# Altium schematic sheet main.SchDoc
size A
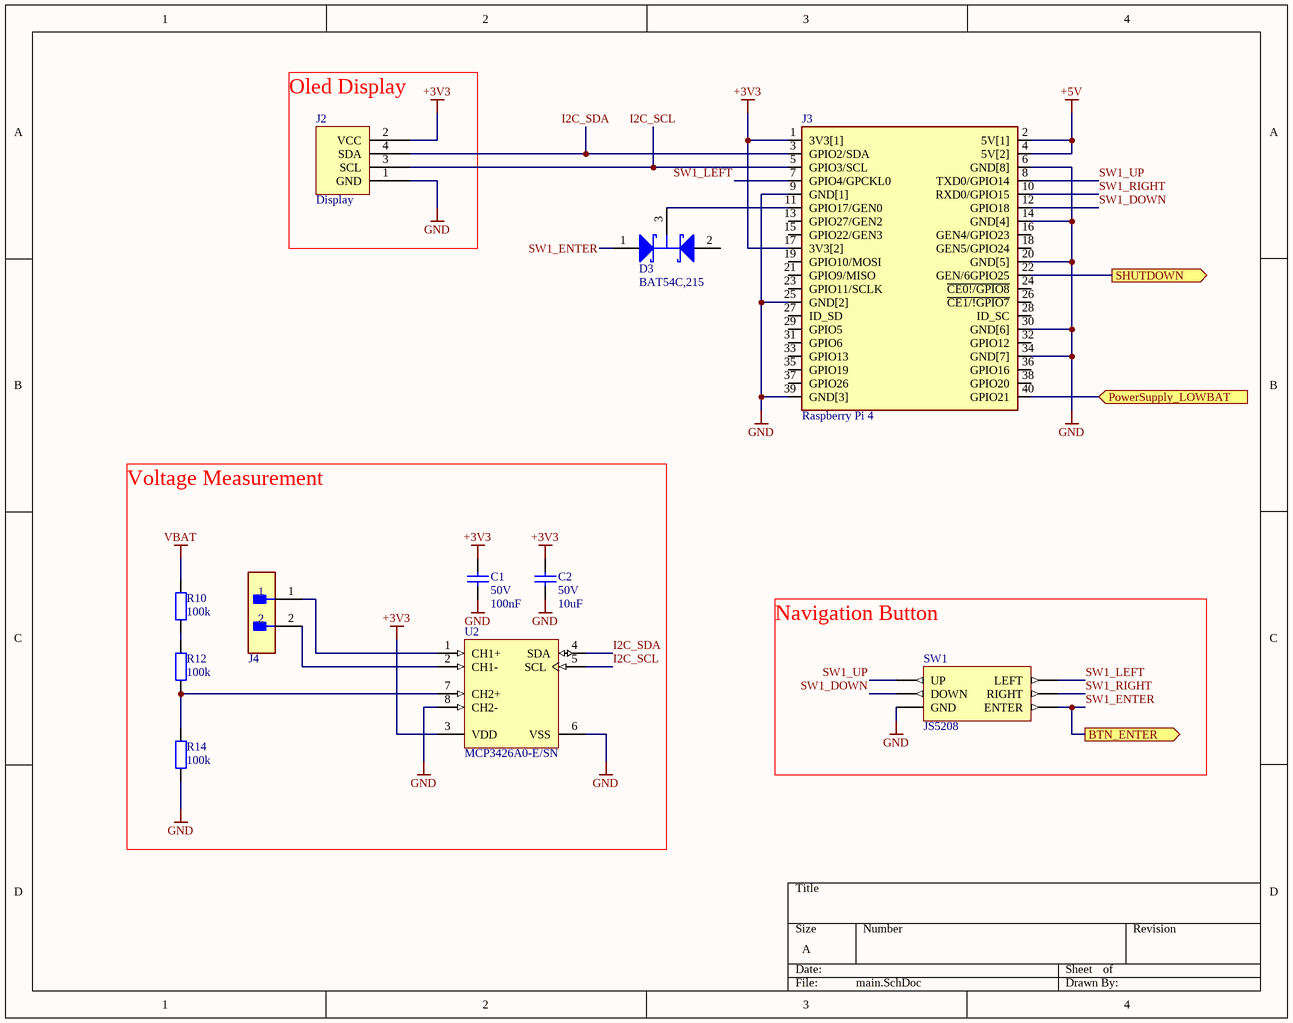
[diagram p0: main.SchDoc]

## Parts
C1  value 100nF  Voltage Rating: 50V  [CAPC2013X88X50NL20T25]  (hidden comment: Cap_0805)
C2  value 10uF  Voltage Rating: 50V  [CAPC2013X88X50NL20T25]  (hidden comment: Cap_0805)
D3  BAT54C,215  [SOT23]
J2  Display  [OLED_DISPLAY]
J3  Raspberry Pi 4  [RASPBERRY_PI_4]
J4  ADC_header  [ADC_HEADER]  (value not drawn)
R10  value 100k  [RESC2013X50X30NL20T20]  (hidden comment: Res_0805)
R12  value 100k  [RESC2013X50X30NL20T20]  (hidden comment: Res_0805)
R14  value 100k  [RESC2013X50X30NL20T20]  (hidden comment: Res_0805)
SW1  JS5208  [JS5208_PKG]
U2  MCP3426A0-E/SN  [SOIC-SN8_L]

## Ports
BTN_ENTER (out), PowerSupply_LOWBAT (in), SHUTDOWN (out)

## Nets
+3V3: C1.2 C2.2 J2.2(VCC) J3.1(3V3[1]) J3.17(3V3[2]) U2.3(VDD)
+5V: J3.2(5V[1]) J3.4(5V[2])
GND: C1.1 C2.1 J2.1(GND) J3.6(GND[8]) J3.9(GND[1]) J3.14(GND[4]) J3.20(GND[5]) J3.25(GND[2]) J3.30(GND[6]) J3.34(GND[7]) J3.39(GND[3]) R14.1 SW1.COM(GND) U2.6(VSS) U2.8(CH2-)
VBAT: R10.2
I2C_SCL: J2.3(SCL) J3.5(GPIO3/SCL) U2.5(SCL)
I2C_SDA: J2.4(SDA) J3.3(GPIO2/SDA) U2.4(SDA)
PowerSupply_LOWBAT: J3.40(GPIO21) ; port PowerSupply_LOWBAT
SHUTDOWN: J3.22(GEN/6GPIO25) ; port SHUTDOWN
SW1_DOWN: J3.12(GPIO18) SW1.C-D(DOWN)
SW1_ENTER: D3.1(A) SW1.E-BTN(ENTER) ; port BTN_ENTER
SW1_LEFT: J3.7(GPIO4/GPCKL0) SW1.B-L(LEFT)
SW1_RIGHT: J3.10(RXD0/GPIO15) SW1.D-R(RIGHT)
SW1_UP: J3.8(TXD0/GPIO14) SW1.A-U(UP)
NetD3_3: D3.3(K) J3.11(GPIO17/GEN0)
NetJ4_1: J4.1 U2.1(CH1+)
NetJ4_2: J4.2 U2.2(CH1-)
NetR10_1: R10.1 R12.2
NetR12_1: R12.1 R14.2 U2.7(CH2+)

Not connected (* = marked no-connect by the designer): D3 2(A); J3 13(GPIO27/GEN2) 15(GPIO22/GEN3) 16(GEN4/GPIO23) 18(GEN5/GPIO24) 19(GPIO10/MOSI) 21(GPIO9/MISO) 23(GPIO11/SCLK) 24(~{CE0!/GPIO8}) 26(~{CE1/!GPIO7}) 27(ID_SD) 28(ID_SC) 29(GPIO5) 31(GPIO6) 32(GPIO12) 33(GPIO13) 35(GPIO19) 36(GPIO16) 37(GPIO26) 38(GPIO20)

## Notes on the sheet
- (near J2) Oled Display
- (near SW1) Navigation Button
- Voltage Measurement

## Library data of the parts
C1 C2 = Cap_0805: Ceramic Capacitor X7R
D3 = DIODE_BAT54C: Schottky Barrier Diode, 30 V, 3-Pin SOT23, RoHS, Tape and Reel; Manufacturer: NXP Semiconductors; Forward Surge Current Ifsm Max: 600mA; Pin Configuration: 1A1,2A2,3comK; Package Version: Feb-16; Forward Voltage VF Max: 800mV; SMD Marking: L43/*W1; Diode Case Style: SOT-23; Reverse Recovery Time trr Typ: 5ns; Forward Current If(AV): 200mA; Reel Quantity: 3000; SVHC: NoSVHC(19-Dec-2012); No. of Pins: 3; Junction Temperature Tj Max: 125degC; Common Connection: Cathode; Repetitive Reverse Voltage Vrrm Max: 30V; Operating Temperature Max: 150degC; Operating Temperature Range: -65degCto+150degC; Termination Type: SMD; Package Description: 3-Pin Small Outline Transistor, Body 1.3 x 2.9 mm, Pitch 0.95 mm; Package / Case: SOT-23; Diode Type: Schottky; Manufacturer URL: http://www.nxp.com/; Tape Width: 8mm; Package Reference: SOT23-3; Datasheet URL: https://datasheet.ciiva.com/33723/1668625-33723936.pdf; Datasheet Version: Rev. 5 , 10/2012; Operating Temperature Min: -65degC; Current Ifsm: 600mA; Reverse Recovery Time trr Max: 5ns; Package URL: http://www.nxp.com/documents/outline_drawing/SOT23.pdf; Forward Voltage: 800mV
J2 = Oled Display: Tiger Claw(TM) Socket Strip, Through-hole, Vertical, -55 to 105 degC, 2 mm Pitch, 4-Pin, Female, RoHS; Manufacturer: Samtec; PartNumber: MMS-104-01-T-SV; Pitch: 2 mm; PackageDescription: 2mm Through Hole Box Connector Strip Assembly; DatasheetVersion: F-214; ComponentLink1URL: http://www.samtec.com; RoHS: True; Temperature Range: -55 to 105 degC; ComponentLink1Description: Manufacturer URL; Mounting Technology: Through-hole; ComponentLink2Description: Datasheet; Orientation: Vertical; ComponentLink2URL: http://www.samtec.com/documents/webfiles/pdf/MMS.PDF; ComponentLink3Description: Package Specification; ComponentLink3URL: http://www.samtec.com/documents/webfiles/cpdf/MMS-1XX-01-XXX-XX-XXX-MKT1.pdf; PackageVersion: AO, 2/1993; PackageReference: MMS-104-01-X-SV
J3 = RASPBERRY_PI4: Raspberry Pi 4 with Headers_; MP: ADA3708; Availability: Unavailable; Package: None; MF: Raspberry Pi; Value: *; Price: None; SnapEDA_Link: https://www.snapeda.com/parts/ADA3708/Raspberry%20Pi/view-part/2770118/?ref=snap
R10 R12 R14 = Res_0805: Resistor; Tolerance: 1%; Power Rating: 125mW
SW1 = NAV_BUTTON: E-SWITCH - JS5208 - SWITCH, NAVIGATION, 5 POSITION, 20mA, SMD; Mechanical Life: 100000Cycles; Voltage Rating (DC): 15V; Operating Force: 500gf; Supplier 1: Digi-Key; Manufacturer: E-Switch; RoHS: Yes; Category: Switches; Stock 1: 2460; Pricing 1: 1=2.49000, 5=2.43200, 10=2.04400, 25=1.93360, 50=1.82320, 100=1.65750 (USD); Mount: Surface Mount; Number of Pins: 5; Contact Material: Silver; Min Operating Temperature: -20°C; Max Operating Temperature: 70°C; Termination: Gull Wing; Electrical Life: 100000Cycles; Current Rating: 20mA; Package Quantity: 300; Lead Free: Lead Free; REACH SVHC: No SVHC; ComponentLink1URL: https://datasheet.ciiva.com/1530/js5208-1530917.pdf?src-supplier=Element14; ComponentLink1Description: https://datasheet.ciiva.com/1530/js5208-1530917.pdf?src-supplier=Element14; ComponentLink2URL: https://datasheet.ciiva.com/12447/js5208-19824-12447191.pdf?src-supplier=Mouser; ComponentLink2Description: https://datasheet.ciiva.com/12447/js5208-19824-12447191.pdf?src-supplier=Mouser; ComponentLink3URL: https://datasheet.ciiva.com/2869/p200020c-2869289.pdf?src-supplier=Digi-Key; ComponentLink3Description: https://datasheet.ciiva.com/2869/p200020c-2869289.pdf?src-supplier=Digi-Key; ComponentLink4URL: https://datasheet.ciiva.com/16360/js5208-16360789.pdf?src-supplier=Future+Electronics; ComponentLink4Description: https://datasheet.ciiva.com/16360/js5208-16360789.pdf?src-supplier=Future+Electronics; Supplier Part Number 1: EG4561-ND; Manufacturer Part Number: JS5208
U2 = CMP-0188-01151-1: 16-Bit, Multi-Channel Delta-Sigma Analog-to-Digital Converter with I2C Interface and On-Board Reference, 8-Pin SOIC 150mil, Extended Temperature; ComponentLink2Description: Datasheet; ComponentLink3Description: Package Specification; PackageVersion: revBB, Aug-2009; Code_JEDEC: MS-012; Code_IPC: SOIC127P600-8; PackageDescription: 8-Lead Plastic Small Outline (SN) - Narrow, 3.90mm Body [SOIC]; ComponentLink1Description: Manufacturer URL; ComponentLink2URL: http://ww1.microchip.com/downloads/en/DeviceDoc/22226a.pdf; ComponentLink1URL: http://www.microchip.com/; DatasheetVersion: revA, Dec-2009; ComponentLink3URL: http://www.microchip.com/stellent/groups/techpub_sg/documents/packagingspec/en012702.pdf; PackageReference: SOIC-SN8